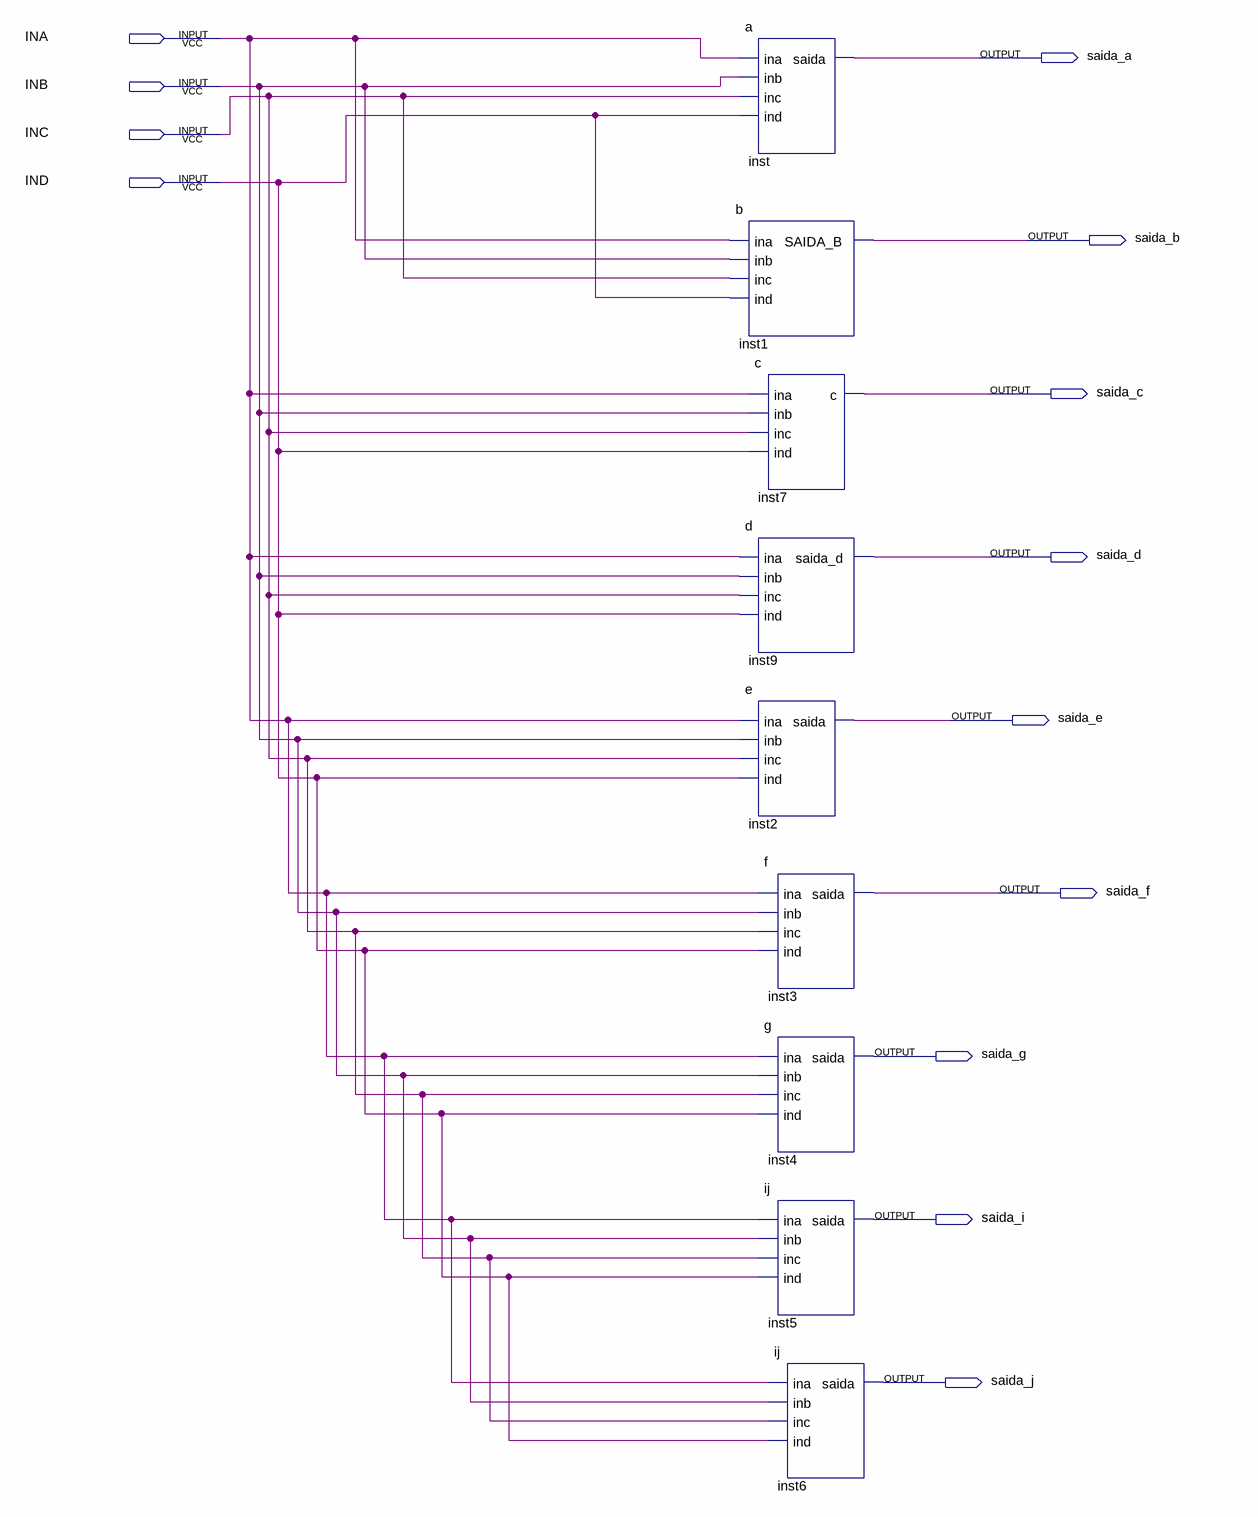
[diagram p0: schematic sheet]
// Quartus schematic completo.bdf as structural Verilog: 9 symbols, 13 pins
module completo (
  input  INA,
  input  INB,
  input  INC,
  input  IND,
  output saida_a,
  output saida_b,
  output saida_c,
  output saida_d,
  output saida_e,
  output saida_f,
  output saida_g,
  output saida_i,
  output saida_j
);

  a inst (.ina(INA), .inb(INB), .inc(INC), .ind(IND), .saida(saida_a));
  b inst1 (.ina(INA), .inb(INB), .inc(INC), .ind(IND), .SAIDA_B(saida_b));
  c inst7 (.ina(INA), .inb(INB), .inc(INC), .ind(IND), .c(saida_c));
  d inst9 (.ina(INA), .inb(INB), .inc(INC), .ind(IND), .saida_d(saida_d));
  e inst2 (.ina(INA), .inb(INB), .inc(INC), .ind(IND), .saida(saida_e));
  f inst3 (.ina(INA), .inb(INB), .inc(INC), .ind(IND), .saida(saida_f));
  g inst4 (.ina(INA), .inb(INB), .inc(INC), .ind(IND), .saida(saida_g));
  ij inst5 (.ina(INA), .inb(INB), .inc(INC), .ind(IND), .saida(saida_i));
  ij inst6 (.ina(INA), .inb(INB), .inc(INC), .ind(IND), .saida(saida_j));
endmodule
